# Altium schematic sheet On_Off_switch.SchDoc
size A4; SheetNumber: 3; SheetTotal: 13
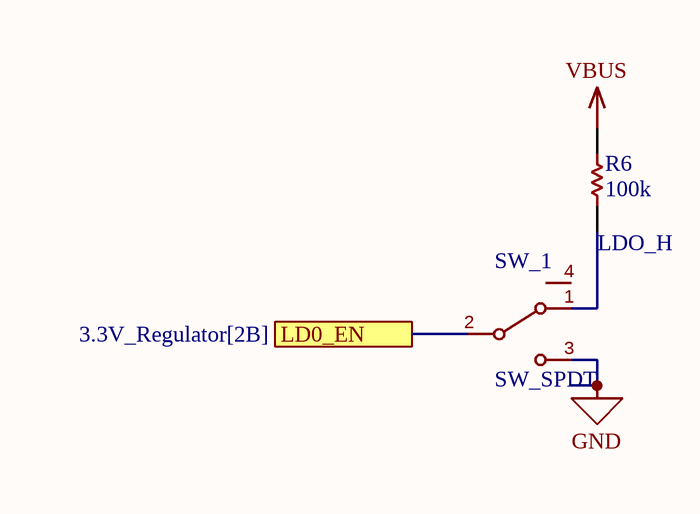
[diagram p0: On_Off_switch.SchDoc]

## Parts
R6  100k  [RESC2013X70X40NL20T20]
SW_1  SW_SPDT  [SW_MPB06-1C00-R-SMT-TR]

## Ports
LD0_EN (see 3.3V_Regulator[2B])

## Nets
GND: SW_1.3(C)
VBUS: R6.2
LD0_EN: SW_1.2(B) ; port LD0_EN
NetR6_1: R6.1 SW_1.1(A)

Not connected (* = marked no-connect by the designer): SW_1 4

## Notes on the sheet
- (near R6) LDO_H

## Library data of the parts
R6 = CMP-2100-03671-1: Chip Resistor, 1 KOhm, +/- 1%, 125 mW, -55 to 155 degC, 0805 (2012 Metric), RoHS, Tape and Reel; Manufacturer: Yageo; Temperature Coefficient: 100ppm/degreesC; Voltage Rating (DC): 150V; Max Power Dissipation: 125mW; Resistance: 1KOhm; Number of Pins: 2; Number of Terminations: 2; Datasheet URL: http://www.yageo.com/NewPortal/yageodocoutput?fileName=/pdf/R-Chip/PYu-RC_Group_51_RoHS_L_5.pdf; Length: 0.079inch; Package Description: 2-Pin Surface Mounted Device, Body 2 x 1.25 mm; Depth: 1.25mm; Height: 0.024inch; Military Standard: Not; Case/Package: 0805; Package Reference: 0805; RoHSCompliant: true; Lead Free: LeadFree; Packaging: TapeandReel; Package Quantity: 1; Datasheet Version: Rev. 5, 10/2016; Tolerance: 1%; Min Operating Temperature: -55degC; Voltage Rating: 150V; Composition: ThickFilm; Case Code (Imperial): 0805; Power Rating: 125mW; Width: 0.049inch; Case Code (Metric): 2012; Manufacturer URL: http://www.yageo.com/; Max Operating Temperature: 155degC; REACH SVHC: Unknown; Termination: SMD/SMT